# EAGLE design torque (EAGLE 8.2.2)
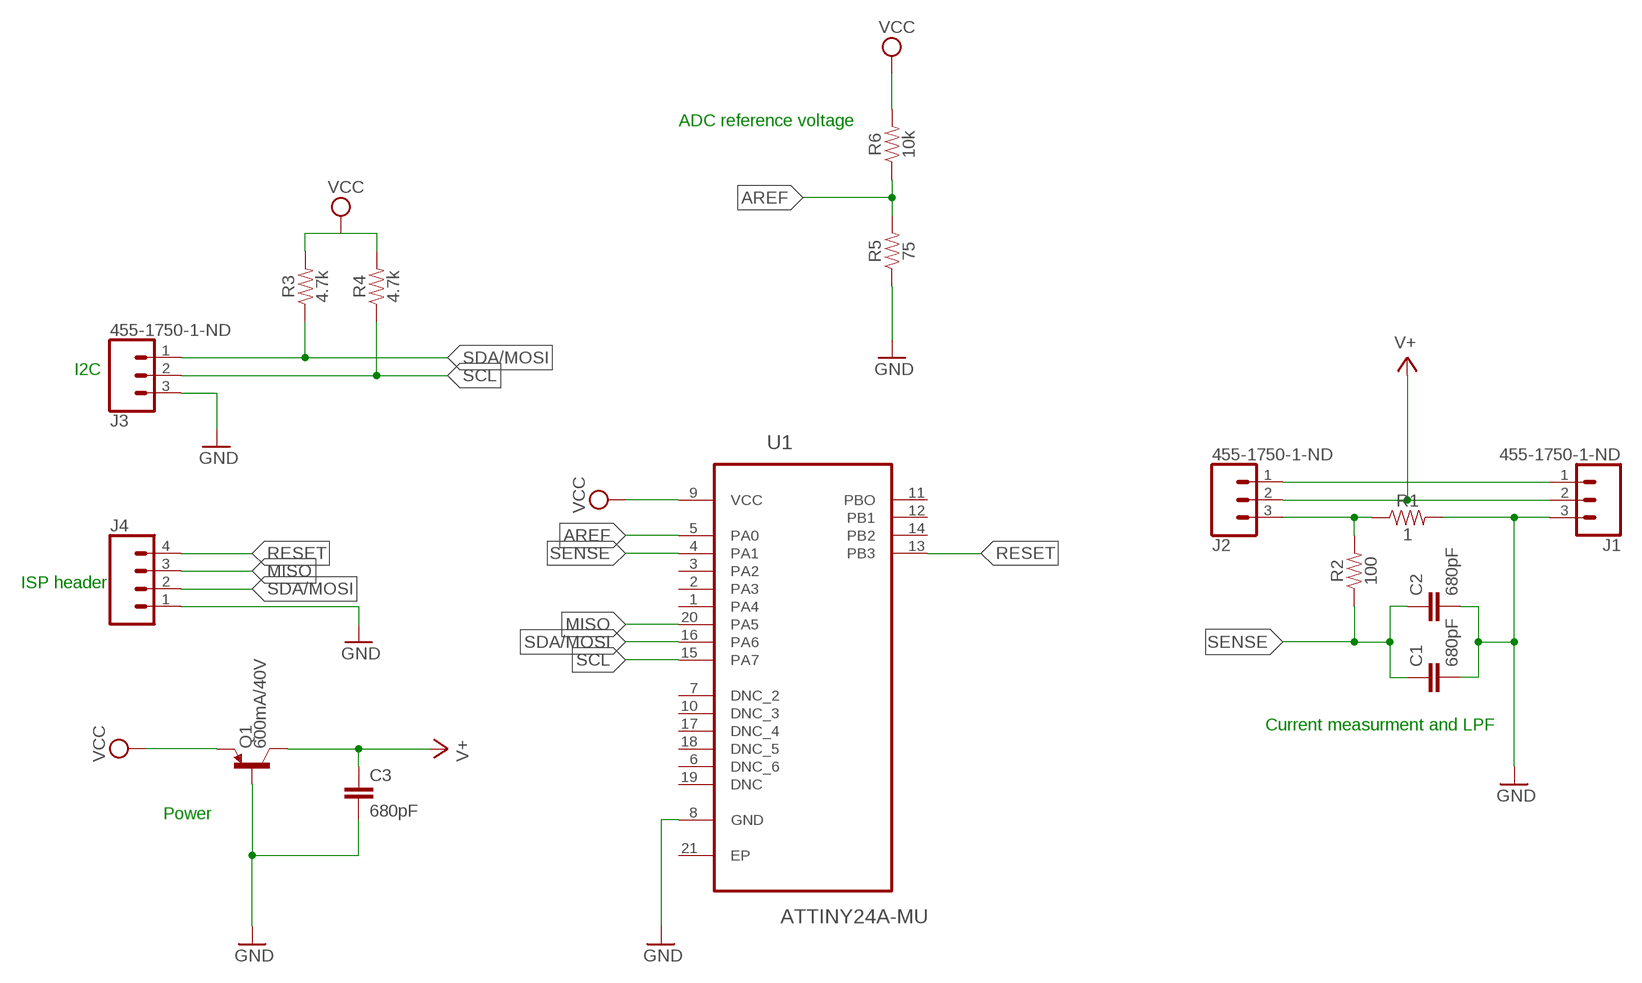
[diagram p0: schematic, sheet 1]

## Parts
C1  680pF  680PF-0603-50V-10%  [0603]
C2  680pF  680PF-0603-50V-10%  [0603]
C3  680pF  680PF-0603-50V-10%  [0603]
J1  455-1750-1-ND  CONN_03  [1X03]
J2  455-1750-1-ND  CONN_03  [1X03]
J3  455-1750-1-ND  CONN_03  [1X03]
J4  CONN_04SMD_RA_FEMALE  [1X04_SMD_RA_FEMALE]
Q1  600mA/40V  TRANS_PNP-MMBT4403  [SOT23-3]
R1  1  1OHM-0603-1/10W-1%  [0603]
R2  100  100OHM-0603-1/10W-1%  [0603]
R3  4.7k  4.7KOHM-0603-1/10W-1%  [0603]
R4  4.7k  4.7KOHM-0603-1/10W-1%  [0603]
R5  75  75KOHM-0603-1/10W-1%  [0603]
R6  10k  10KOHM-0603-1/10W-1%  [0603]
U1  ATTINY24A-MU  [QFN50P400X400X80-21N]

## Nets
AREF: R5.2 R6.1 U1.5(PA0)
GND: C1.2 C2.2 C3.2 J1.3 J3.3 J4.1 Q1.1(B) R1.2 R5.1 U1.8(GND)
MISO: J4.3 U1.20(PA5)
N$2: J2.3 R1.1 R2.2
N$3: J1.1 J2.1
N$5: R3.2 R4.2
RESET: J4.4 U1.13(PB3)
SCL: J3.2 R4.1 U1.15(PA7)
SDA/MOSI: J3.1 J4.2 R3.1 U1.16(PA6)
SENSE: C1.1 C2.1 R2.1 U1.4(PA1)
V+: C3.1 J1.2 J2.2 Q1.3(C)
VCC: Q1.2(E) R6.2 U1.9(VCC)
Unconnected: U1.1(PA4) U1.2(PA3) U1.3(PA2) U1.6(DNC_6) U1.7(DNC_2) U1.10(DNC_3) U1.11(PBO) U1.12(PB1) U1.14(PB2) U1.17(DNC_4) U1.18(DNC_5) U1.19(DNC) U1.21(EP)

## Notes on the sheet
- ADC reference voltage
- I2C
- ISP header
- Current measurment and LPF
- Power

## Library data of the parts
C1-C3 = SparkFun-Capacitors:680PF: 680pF/0.68nF ceramic capacitors A capacitor is a passive two-terminal electrical component used to store electrical energy temporarily in an electric field.; PROD_ID: CAP-09232
J1-J3 = SparkFun-Connectors:CONN_03: Multi connection point. Often used as Generic Header-pin footprint for 0.1 inch spaced/style header connections On any of the 0.1 inch spaced packages, you can populate with these: Break Away Headers - Straight <https://www.sparkfun.com/products/116> (PRT-00116) Break Away Male Headers - Right Angle <https://www.sparkfun.com/products/553> (PRT-00553) Female Headers <https://www.sparkfun.com/products/115> (PRT-00115) Break Away Headers - Machine Pin <https://www.sparkfun.com/products/117> (PRT-00117) Break Away Female Headers - Swiss Machine Pin <https://www.sparkfun.com/products/743> (PRT-00743) Stackable Header - 3 Pin (Female, 0.1") <https://www.sparkfun.com/products/13875> (PRT-13875) For SCREWTERMINALS and SPRING TERMINALS visit here: Screw Terimnals on SparkFun.com <https://www.sparkfun.com/search/results?term=Screw+Terminals> (5mm/3.5mm/2.54mm spacing) This device is also useful as a general connection point to wire up your design to another part of your project. Our various solder wires solder well into these plated through hole pads. Hook-Up Wire - Assortment (Stranded, 22 AWG) <https://www.sparkfun.com/products/11375> (PRT-11375) Hook-Up Wire - Assortment (Solid Core, 22 AWG) <https://www.sparkfun.com/products/11367> (PRT-11367) View the entire wire category on our website here <https://www.sparkfun.com/categories/141> Special notes: Molex polarized connector foot print use with SKU : PRT-08232 with associated crimp pins and housings.; PROD_ID: XXX-00000
J4 = SparkFun-Connectors:CONN_04: Multi connection point. Often used as Generic Header-pin footprint for 0.1 inch spaced/style header connections On any of the 0.1 inch spaced packages, you can populate with these: Break Away Headers - Straight <https://www.sparkfun.com/products/116> (PRT-00116) Break Away Male Headers - Right Angle <https://www.sparkfun.com/products/553> (PRT-00553) Female Headers <https://www.sparkfun.com/products/115> (PRT-00115) Break Away Headers - Machine Pin <https://www.sparkfun.com/products/117> (PRT-00117) Break Away Female Headers - Swiss Machine Pin <https://www.sparkfun.com/products/743> (PRT-00743) For SCREWTERMINALS and SPRING TERMINALS visit here: Screw Terimnals on SparkFun.com <https://www.sparkfun.com/search/results?term=Screw+Terminals> (5mm/3.5mm/2.54mm spacing) This device is also useful as a general connection point to wire up your design to another part of your project. Our various solder wires solder well into these plated through hole pads. Hook-Up Wire - Assortment (Stranded, 22 AWG) <https://www.sparkfun.com/products/11375> (PRT-11375) Hook-Up Wire - Assortment (Solid Core, 22 AWG) <https://www.sparkfun.com/products/11367> (PRT-11367) View the entire wire category on our website here <https://www.sparkfun.com/categories/141> Special notes: Molex polarized connector foot print use with SKU : PRT-08231 with associated crimp pins and housings. 1MM SMD Version SKU: PRT-10208; PROD_ID: CONN-12382
Q1 = SparkFun-DiscreteSemi:TRANS_PNP: PNP transistor Current controlled devices typically used to amplify current or used as a switch. SparkFun Products: SparkFun Serial Enabled 16x2 LCD - Red on Black <https://www.sparkfun.com/products/9068> SparkFun Logomatic <https://www.sparkfun.com/products/12772>; PROD_ID: TRANS-09245
R1 = SparkFun-Resistors:1OHM: 1Ω resistor A resistor is a passive two-terminal electrical component that implements electrical resistance as a circuit element. Resistors act to reduce current flow, and, at the same time, act to lower voltage levels within circuits. - Wikipedia; PROD_ID: RES-08269
R2 = SparkFun-Resistors:100OHM: 100Ω resistor A resistor is a passive two-terminal electrical component that implements electrical resistance as a circuit element. Resistors act to reduce current flow, and, at the same time, act to lower voltage levels within circuits. - Wikipedia; PROD_ID: RES-07863
R3 R4 = SparkFun-Resistors:4.7KOHM: 4.7kΩ resistor A resistor is a passive two-terminal electrical component that implements electrical resistance as a circuit element. Resistors act to reduce current flow, and, at the same time, act to lower voltage levels within circuits. - Wikipedia; PROD_ID: RES-07857
R5 = SparkFun-Resistors:75KOHM: 75Ω resistor A resistor is a passive two-terminal electrical component that implements electrical resistance as a circuit element. Resistors act to reduce current flow, and, at the same time, act to lower voltage levels within circuits. - Wikipedia; PROD_ID: RES-09737
R6 = SparkFun-Resistors:10KOHM: 10kΩ resistor A resistor is a passive two-terminal electrical component that implements electrical resistance as a circuit element. Resistors act to reduce current flow, and, at the same time, act to lower voltage levels within circuits. - Wikipedia; PROD_ID: RES-00824
U1 = Atmel_By_element14_Batch_1-00:ATTINY24A-MU: Microcontroller; MPN: ATTINY24A-MU; OC_FARNELL: 1748542; OC_NEWARK: 26R5649; PACKAGE: QFN-20; SUPPLIER: Atmel

## Board
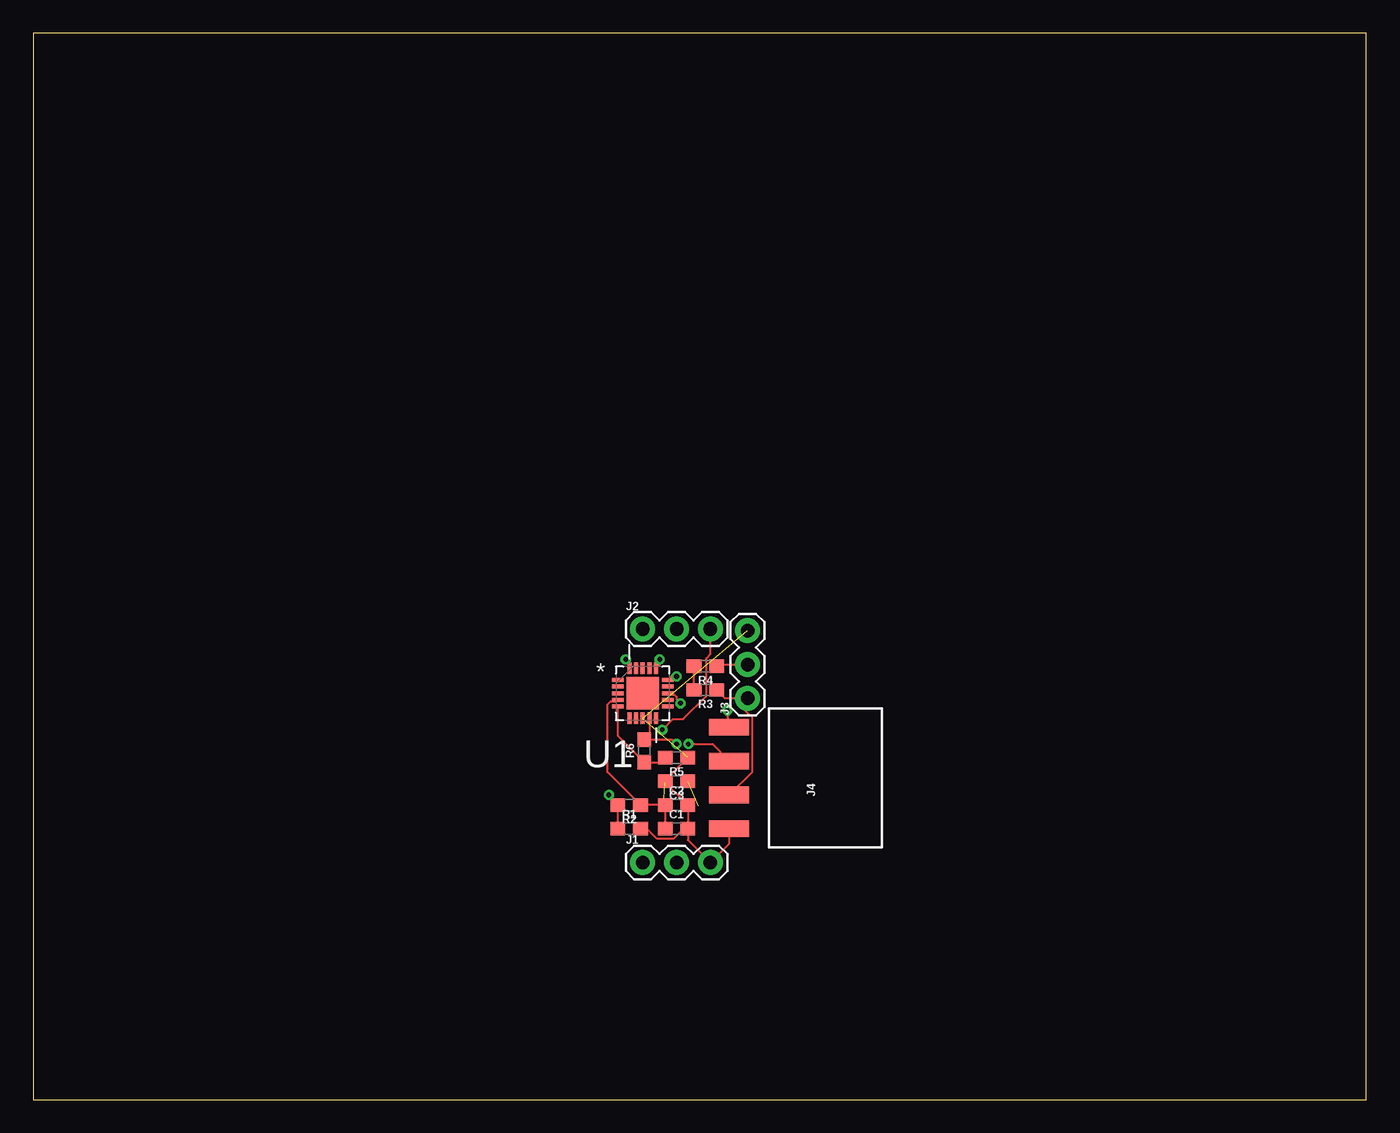
[diagram p1: board, top side]
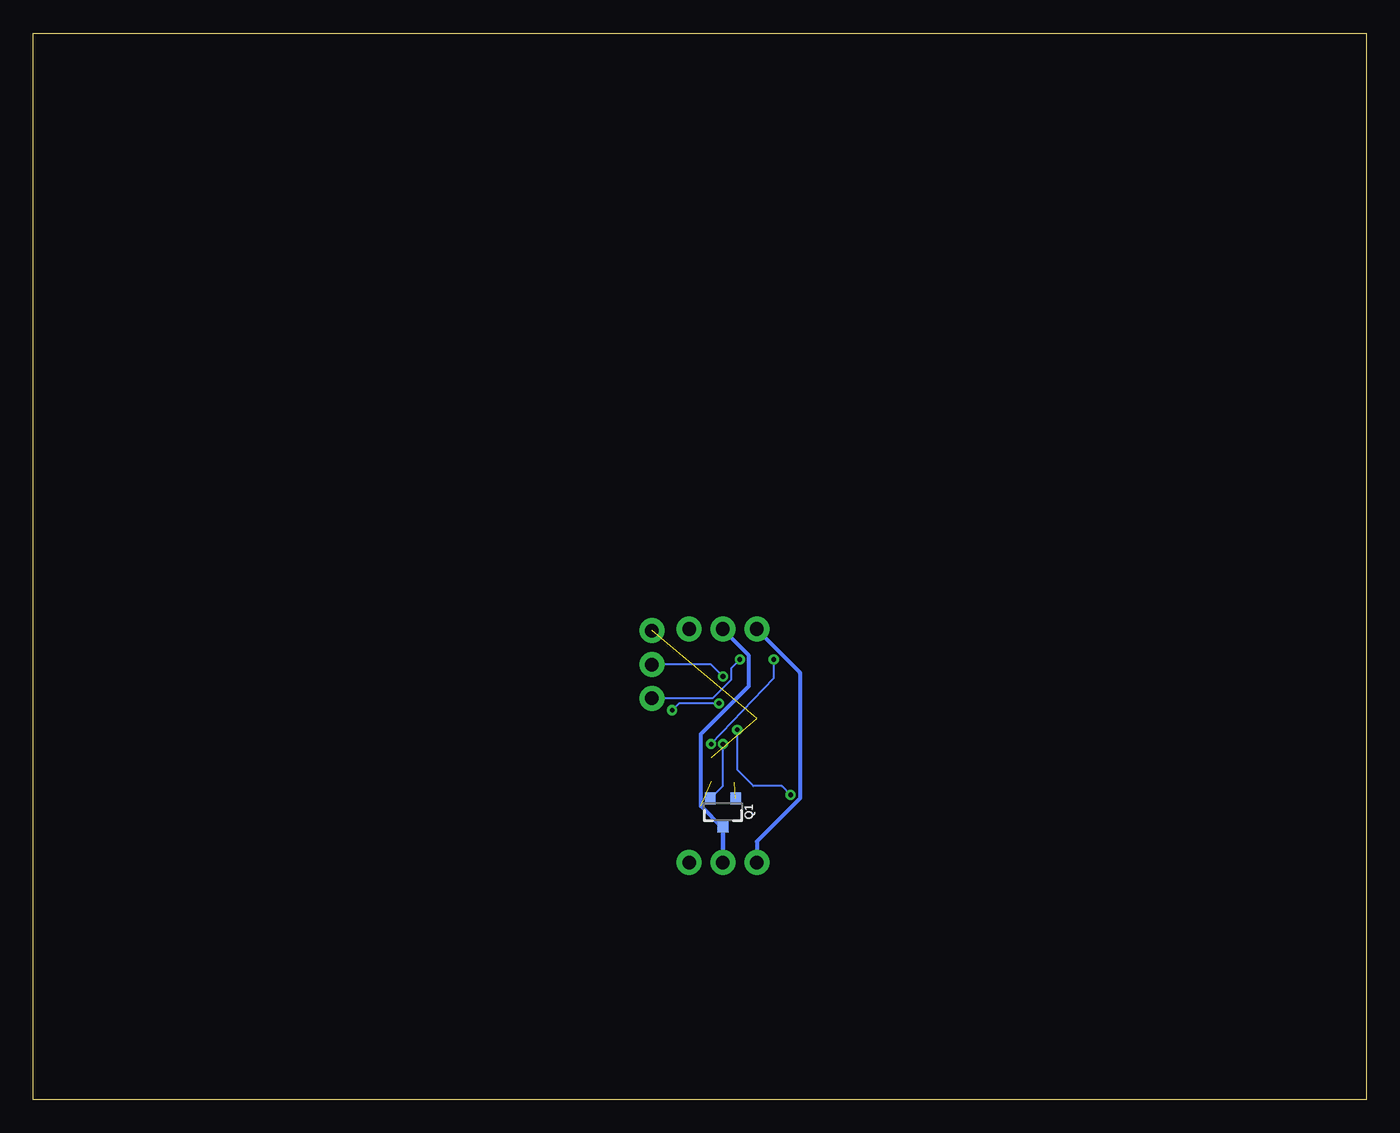
[diagram p2: board, bottom side, seen from below]

Size 100 x 80 mm. Coordinates in mm from the lower left corner, seen from the top.
Outline: 0,0 100,0 100,80 0,80 0,0
Copper layers (1*16): Top 0.035mm / dielectric 1.5mm / Bottom 0.035mm
Design rules "default": minimum track width 6mil, minimum drill 0.35mm, track to track 6mil, track to pad 6mil, pad to pad 6mil, via to via 6mil, smd to smd 6mil, copper to edge 40mil, drill to drill 6mil, minimum pad ring 10mil, minimum via ring 8mil, stop-mask expansion 4mil, vias tented up to drill 0mil, thermal gap 10mil

### Footprints (pad centres in the part's own frame; a part is rotated, then mirrored left to right if it is on the bottom)
0603 = smd 1.1 x 1: 1 -0.85,0; 2 0.85,0
1X03 = drill 1.016 pad 1.88: 1 0,0; 2 2.54,0; 3 5.08,0
1X04_SMD_RA_FEMALE = smd 1.25 x 3: 1 -3.81,7.225; 2 -1.27,7.225; 3 1.27,7.225; 4 3.81,7.225
SOT23-3 = smd 0.8 x 0.9: 1 -0.95,-1; 2 0.95,-1; 3 0,1.1
QFN50P400X400X80-21N = smd 0.864 x 0.305: 1 -1.88,0.991; 2 -1.88,0.508; 3 -1.88,0; 4 -1.88,-0.508; 5 -1.88,-0.991; 11 1.88,-0.991; 12 1.88,-0.508; 13 1.88,0; 14 1.88,0.508; 15 1.88,0.991 | smd 0.305 x 0.864: 6 -0.991,-1.88; 7 -0.508,-1.88; 8 0,-1.88; 9 0.508,-1.88; 10 0.991,-1.88; 16 0.991,1.88; 17 0.508,1.88; 18 0,1.88; 19 -0.508,1.88; 20 -0.991,1.88 | smd 2.438 x 2.438: 21 0,0

### Placement (x,y rotation side)
C1  48.26,20.32 0 top
C2  48.26,22.1 0 top
C3  48.26,23.88 180 top
J1  45.72,17.78 0 top
J2  45.72,35.31 0 top
J3  53.59,30.1 90 top
J4  59.44,24.13 90 top
Q1  48.26,21.59 180 bottom
R1  44.7,20.32 0 top
R2  44.7,22.1 180 top
R3  50.42,30.73 180 top
R4  50.42,32.51 180 top
R5  48.26,25.65 180 top
R6  45.85,26.16 90 top
U1  45.72,30.48 0 top

### Tracks (layer width: path | path; a pad name or v marks a point on that pad's centre or on a via)
AREF
  Top 0.152: R5.2 47.07,25.31 R6.1 43.84,27.32 U1.5
GND  (3 unrouted)
  Top 0.152: R1.2 46.04,20.32 46.77,19.59 48.05,19.59 48.78,20.32 C1.2 | C1.2 49.11,19.47 J1.3 52.21,19.19 J4.1 | C1.2 C2.2 47.41,23.8 C3.2 47.41,23.95 R5.1
MISO  (via drill 0.35)
  Top 0.152: v44.45,33.02 44.73,32.74 U1.20 | J4.3 50.94,26.67 v49.15,26.67
  Bottom 0.152: v49.15,26.67 44.45,31.62 v44.45,33.02
N$2  (via drill 0.35)
  Top 0.152: R1.1 R2.2 43.18,22.77 v43.18,22.86 | J2.3 50.8,33.42 50.49,33.11 50.49,30.28 48.76,28.55 48.01,28.55 47.2,27.74 v47.19,27.74
  Bottom 0.152: v43.18,22.86 43.84,23.52 45.97,23.52 47.19,24.74 v47.19,27.74
N$3
  Bottom 0.305: J1.1 45.72,19.35 42.5,22.58 42.5,32.03 45.72,35.26 J2.1
N$5
  Top 0.152: R3.2 R4.2
RESET  (via drill 0.35)
  Top 0.152: v48.56,29.73 48.26,30.03 48.26,30.22 48,30.48 U1.13 | v52.07,29.21 52.07,28.08 J4.4
  Bottom 0.152: v48.56,29.73 51.55,29.73 v52.07,29.21
SCL  (via drill 0.35)
  Top 0.152: R4.1 51.4,32.64 J3.2 | U1.15 47.88,31.75 v48.26,31.75
  Bottom 0.152: v48.26,31.75 49.15,32.64 J3.2
SDA/MOSI  (via drill 0.35)
  Top 0.152: R3.1 51.9,30.1 53.47,30.1 | 53.47,30.1 J3.1 | U1.16 46.99,32.64 v46.99,33.02 | 53.47,30.1 53.47,29.13 53.94,28.66 53.94,24.59 J4.2
  Bottom 0.152: v46.99,33.02 47.65,32.36 47.65,31.5 49.05,30.1 J3.1
SENSE
  Top 0.152: C1.1 C2.1 R2.1 43.08,24.58 43.08,29.63 43.31,29.87 43.74,29.87 U1.4
V+  (1 unrouted)
  Bottom 0.305: Q1.3 J1.2 48.26,20.36 49.91,22.01 49.91,27.41 46.31,31.02 46.31,33.3 48.26,35.26 J2.2
VCC  (via drill 0.35)
  Top 0.152: 48.24,26.68 v48.26,26.67 47.92,27.01 R6.2 46.23,27.39 U1.9
  Bottom 0.152: Q1.2 48.26,23.54 v48.26,26.67